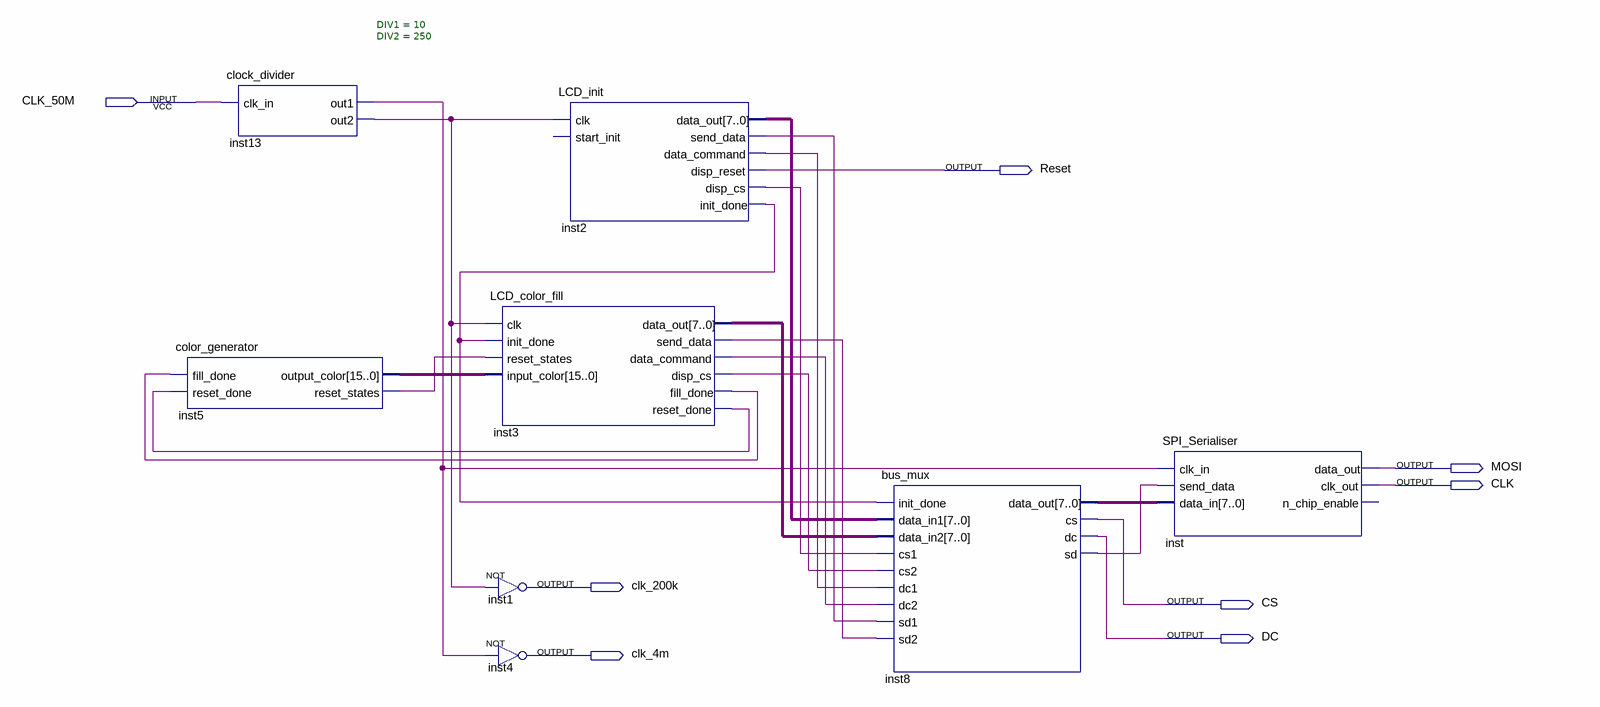
[diagram p0: schematic sheet]
// Quartus schematic ILI9488.bdf as structural Verilog: 8 symbols, 8 pins
module ILI9488 (
  input  CLK_50M,
  output Reset,
  output MOSI,
  output CLK,
  output clk_200k,
  output CS,
  output DC,
  output clk_4m
);

  wire inst2_data_command, inst2_disp_cs, inst2_init_done, inst2_send_data, inst3_data_command,
       inst3_disp_cs, inst3_fill_done, inst3_reset_done, inst3_send_data, inst5_reset_states, inst8_sd,
       inst13_out1, inst13_out2;
  wire [7:0] inst2_data_out, inst3_data_out, inst8_data_out;
  wire [15:0] inst5_output_color;

  color_generator inst5 (
    .fill_done(inst3_fill_done), .reset_done(inst3_reset_done), .output_color(inst5_output_color),
    .reset_states(inst5_reset_states));
  clock_divider #(.DIV1(10), .DIV2(250)) inst13 (.clk_in(CLK_50M), .out1(inst13_out1), .out2(inst13_out2));
  LCD_color_fill inst3 (
    .clk(inst13_out2), .init_done(inst2_init_done), .reset_states(inst5_reset_states),
    .input_color(inst5_output_color), .data_out(inst3_data_out), .send_data(inst3_send_data),
    .data_command(inst3_data_command), .disp_cs(inst3_disp_cs), .fill_done(inst3_fill_done),
    .reset_done(inst3_reset_done));
  not inst1 (clk_200k, inst13_out2);
  not inst4 (clk_4m, inst13_out1);
  LCD_init inst2 (
    .clk(inst13_out2), .data_out(inst2_data_out), .send_data(inst2_send_data),
    .data_command(inst2_data_command), .disp_reset(Reset), .disp_cs(inst2_disp_cs),
    .init_done(inst2_init_done));  // open: start_init
  bus_mux inst8 (
    .init_done(inst2_init_done), .data_in1(inst2_data_out), .data_in2(inst3_data_out), .cs1(inst2_disp_cs),
    .cs2(inst3_disp_cs), .dc1(inst2_data_command), .dc2(inst3_data_command), .sd1(inst2_send_data),
    .sd2(inst3_send_data), .data_out(inst8_data_out), .cs(CS), .dc(DC), .sd(inst8_sd));
  SPI_Serialiser inst (
    .clk_in(inst13_out1), .send_data(inst8_sd), .data_in(inst8_data_out), .data_out(MOSI), .clk_out(CLK));  // open: n_chip_enable
endmodule
